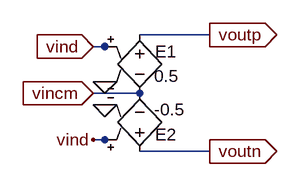
[diagram p0: schematic diff2se.asc]
diff2se.asc, the LTspice schematic file:
Version 4
SHEET 1 880 680
WIRE 272 112 176 112
WIRE 144 128 112 128
WIRE 144 176 128 176
WIRE 176 192 112 192
WIRE 144 208 128 208
WIRE 144 256 112 256
WIRE 272 272 176 272
FLAG 112 128 vind
IOPIN 112 128 In
FLAG 112 192 vincm
IOPIN 112 192 In
FLAG 272 112 voutp
IOPIN 272 112 Out
FLAG 272 272 voutn
IOPIN 272 272 Out
FLAG 128 176 0
FLAG 128 208 0
FLAG 112 256 vind
SYMBOL e 176 96 R0
WINDOW 0 21 39 Left 2
WINDOW 3 20 73 Left 2
SYMATTR InstName E1
SYMATTR Value 0.5
SYMBOL e 176 288 M180
WINDOW 0 21 39 Left 2
WINDOW 3 20 73 Left 2
SYMATTR InstName E2
SYMATTR Value -0.5

The netlist it stands for:
* diff2se.asc
E1 voutp vincm vind 0 0.5
E2 voutn vincm vind 0 -0.5
.backanno
.end